# Altium schematic sheet AirPi2_Power.SchDoc
size A4
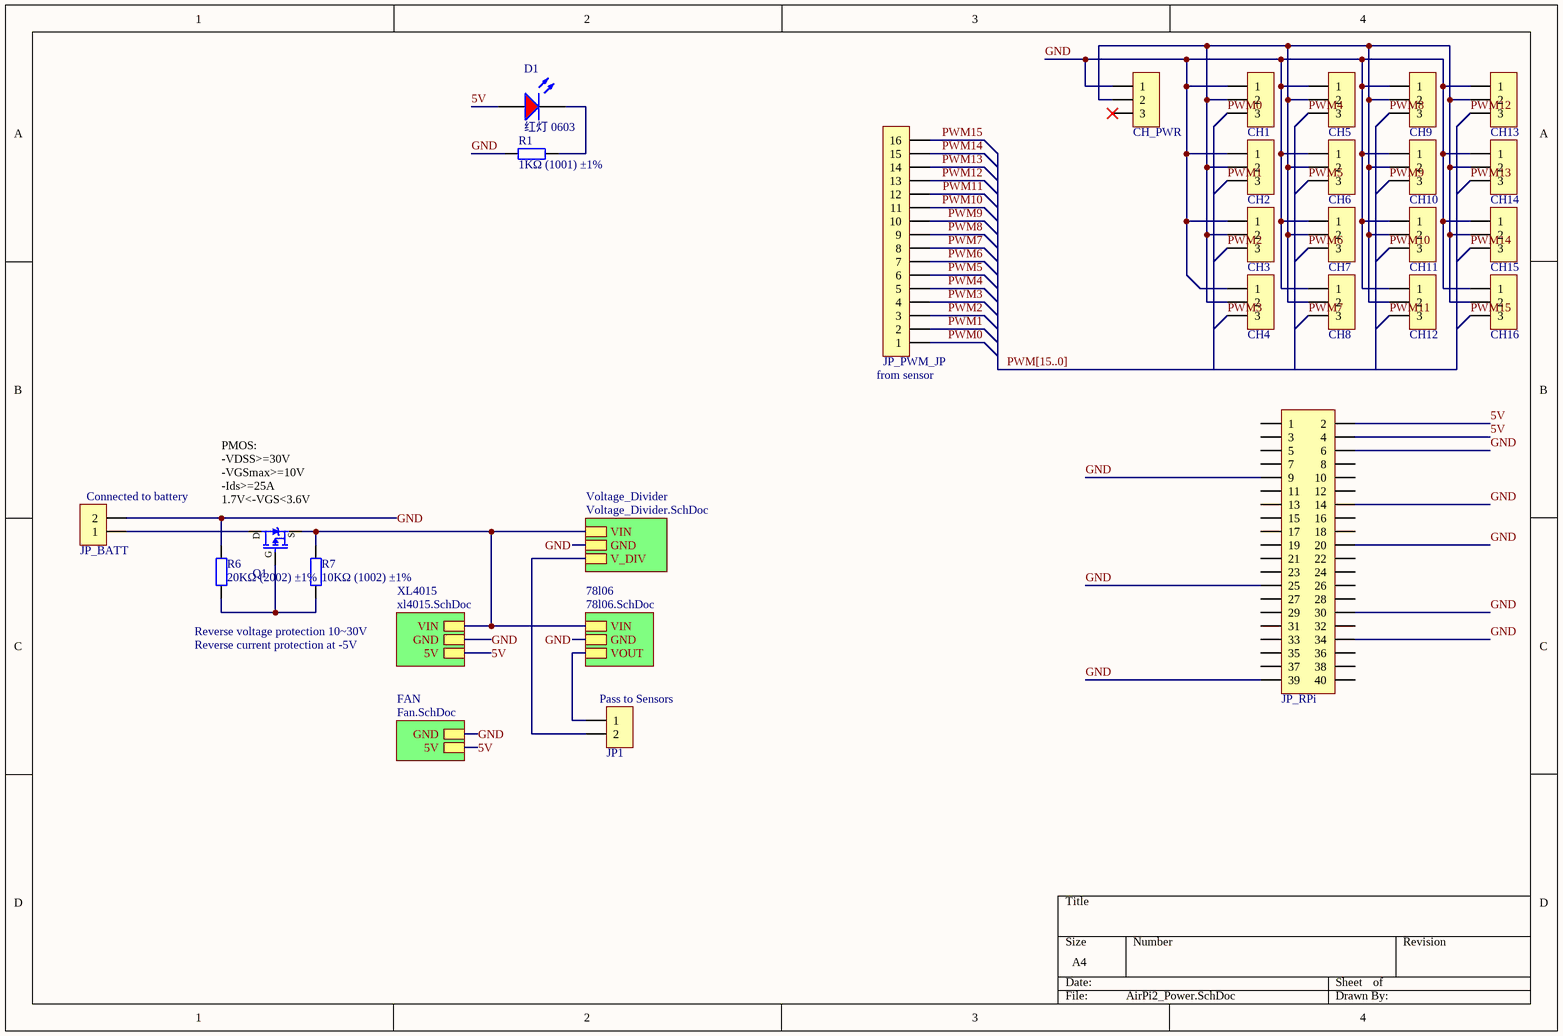
[diagram p0: AirPi2_Power.SchDoc]

## Parts
CH1  HDR-1X3  [HDR2.54-LI-3P]  (value not drawn)
CH2  HDR-1X3  [HDR2.54-LI-3P]  (value not drawn)
CH3  HDR-1X3  [HDR2.54-LI-3P]  (value not drawn)
CH4  HDR-1X3  [HDR2.54-LI-3P]  (value not drawn)
CH5  HDR-1X3  [HDR2.54-LI-3P]  (value not drawn)
CH6  HDR-1X3  [HDR2.54-LI-3P]  (value not drawn)
CH7  HDR-1X3  [HDR2.54-LI-3P]  (value not drawn)
CH8  HDR-1X3  [HDR2.54-LI-3P]  (value not drawn)
CH9  HDR-1X3  [HDR2.54-LI-3P]  (value not drawn)
CH10  HDR-1X3  [HDR2.54-LI-3P]  (value not drawn)
CH11  HDR-1X3  [HDR2.54-LI-3P]  (value not drawn)
CH12  HDR-1X3  [HDR2.54-LI-3P]  (value not drawn)
CH13  HDR-1X3  [HDR2.54-LI-3P]  (value not drawn)
CH14  HDR-1X3  [HDR2.54-LI-3P]  (value not drawn)
CH15  HDR-1X3  [HDR2.54-LI-3P]  (value not drawn)
CH16  HDR-1X3  [HDR2.54-LI-3P]  (value not drawn)
CH_PWR  HDR-1X3  [HDR2.54-LI-3P]  (value not drawn)
D1  红灯 0603  [0603_LED_S1]
JP1  HDR-1X2  [HDR2.54-M-LI-2P]  (value not drawn)
JP_BATT  HDR-1X2  [XH2.54-WI-2P]  (value not drawn)
JP_PWM_JP  HDR-1X16  [HDR2.54-M-LI-16P]  (value not drawn)
JP_RPi  Header 2X11  [HDR2.54-LI-2x20P]  (value not drawn)
Q1  D15P05  [TO252]  (value not drawn)
R1  1KΩ (1001) ±1%  [0805_R]
R6  20KΩ (2002) ±1%  [0805_R]
R7  10KΩ (1002) ±1%  [0805_R]

## Sub-sheets
78l06 = 78l06.SchDoc: GND, VIN, VOUT
FAN = Fan.SchDoc: GND, 5V
Voltage_Divider = Voltage_Divider.SchDoc: VIN, GND, V_DIV
XL4015 = xl4015.SchDoc: VIN, GND, 5V

## Nets
5V: D1.A JP_RPi.2 JP_RPi.4 ; sheet XL4015/5V, sheet FAN/5V
GND: CH1.1 CH2.1 CH3.1 CH4.1 CH5.1 CH6.1 CH7.1 CH8.1 CH9.1 CH10.1 CH11.1 CH12.1 CH13.1 CH14.1 CH15.1 CH16.1 CH_PWR.1 JP_BATT.2 JP_RPi.6 JP_RPi.9 JP_RPi.14 JP_RPi.20 JP_RPi.25 JP_RPi.30 JP_RPi.34 JP_RPi.39 R1.1 R6.2 ; sheet XL4015/GND, sheet FAN/GND, sheet Voltage_Divider/GND, sheet 78l06/GND
PWM0: CH1.3 JP_PWM_JP.1
PWM1: CH2.3 JP_PWM_JP.2
PWM2: CH3.3 JP_PWM_JP.3
PWM3: CH4.3 JP_PWM_JP.4
PWM4: CH5.3 JP_PWM_JP.5
PWM5: CH6.3 JP_PWM_JP.6
PWM6: CH7.3 JP_PWM_JP.7
PWM7: CH8.3 JP_PWM_JP.8
PWM8: CH9.3 JP_PWM_JP.9
PWM9: CH10.3 JP_PWM_JP.10
PWM10: CH11.3 JP_PWM_JP.11
PWM11: CH12.3 JP_PWM_JP.12
PWM12: CH13.3 JP_PWM_JP.13
PWM13: CH14.3 JP_PWM_JP.14
PWM14: CH15.3 JP_PWM_JP.15
PWM15: CH16.3 JP_PWM_JP.16
NetCH1_2: CH1.2 CH2.2 CH3.2 CH4.2 CH5.2 CH6.2 CH7.2 CH8.2 CH9.2 CH10.2 CH11.2 CH12.2 CH13.2 CH14.2 CH15.2 CH16.2 CH_PWR.2
NetD1_K: D1.K R1.2
NetJP1_1: JP1.1 ; sheet 78l06/VOUT
NetJP1_2: JP1.2 ; sheet Voltage_Divider/V_DIV
NetJP_BATT_1: JP_BATT.1 Q1.2(S)
NetQ1_1: Q1.1(G) R6.1 R7.1
NetQ1_3: Q1.3(D) R7.2 ; sheet XL4015/VIN, sheet Voltage_Divider/VIN, sheet 78l06/VIN

Not connected (* = marked no-connect by the designer): CH_PWR 3*; JP_RPi 1 3 5 7 8 10 11 12 13 15 16 17 18 19 21 22 23 24 26 27 28 29 31 32 33 35 36 37 38 40

## Buses and harness runs
bus PWM[15..0]

## Notes on the sheet
- (near JP_PWM_JP) from sensor
- (near JP_BATT) Connected to battery
- (near Q1) PMOS:
  -VDSS>=30V
  -VGSmax>=10V
  -Ids>=25A
  1.7V<-VGS<3.6V
- Reverse voltage protection 10~30V
- Reverse current protection at -5V
- (near JP1) Pass to Sensors

## Library data of the parts
CH1-CH16 CH_PWR = Header 3: 3P接插件; 版权归属: 源创客; BOM名称: 3P接插件; 学习资源: www.ooocke.com
D1 = 0603 红灯: 发光二极管; ComponentLink1Description: 供应商链接; ComponentLink1URL: http://www.szlcsc.com/product/details_2659.html; Package: 0603; Supplier: LC; SuppliersPartNumber: C2286
JP1 JP_BATT = Header 2: 2P接插件; 版权归属: 源创客; BOM名称: 2P接插件; 学习资源: www.ooocke.com
JP_PWM_JP = Header 16: 16P接插件; 版权归属: 源创客; BOM名称: 16P接插件; 学习资源: www.ooocke.com
JP_RPi = Header 20X2: 20*2P接插件; 版权归属: 源创客; BOM名称: 20*2P接插件; 学习资源: www.ooocke.com
Q1 = D15P05: P沟道 50V/15A; BOM名称: 场效应管; 版权归属: 源创客; 学习资源: www.ooocke.com; 描述: P沟道 50V/15A
R1 = 0805 1KΩ (1001) 1%: 贴片电阻; ComponentLink1Description: 供应商链接; ComponentLink1URL: http://www.szlcsc.com/product/details_18201.html; Package: 0805; Supplier: LC; SuppliersPartNumber: C17513
R6 = 0805 20KΩ (2002) 1%: 贴片电阻; ComponentLink1Description: 供应商链接; ComponentLink1URL: http://www.szlcsc.com/product/details_4735.html; Package: 0805; Supplier: LC; SuppliersPartNumber: C4328
R7 = 0805 10KΩ (1002) 1%: 贴片电阻; ComponentLink1Description: 供应商链接; ComponentLink1URL: http://www.szlcsc.com/product/details_18102.html; Package: 0805; Supplier: LC; SuppliersPartNumber: C17414